# EAGLE design WiFiCPU (EAGLE 6.3)
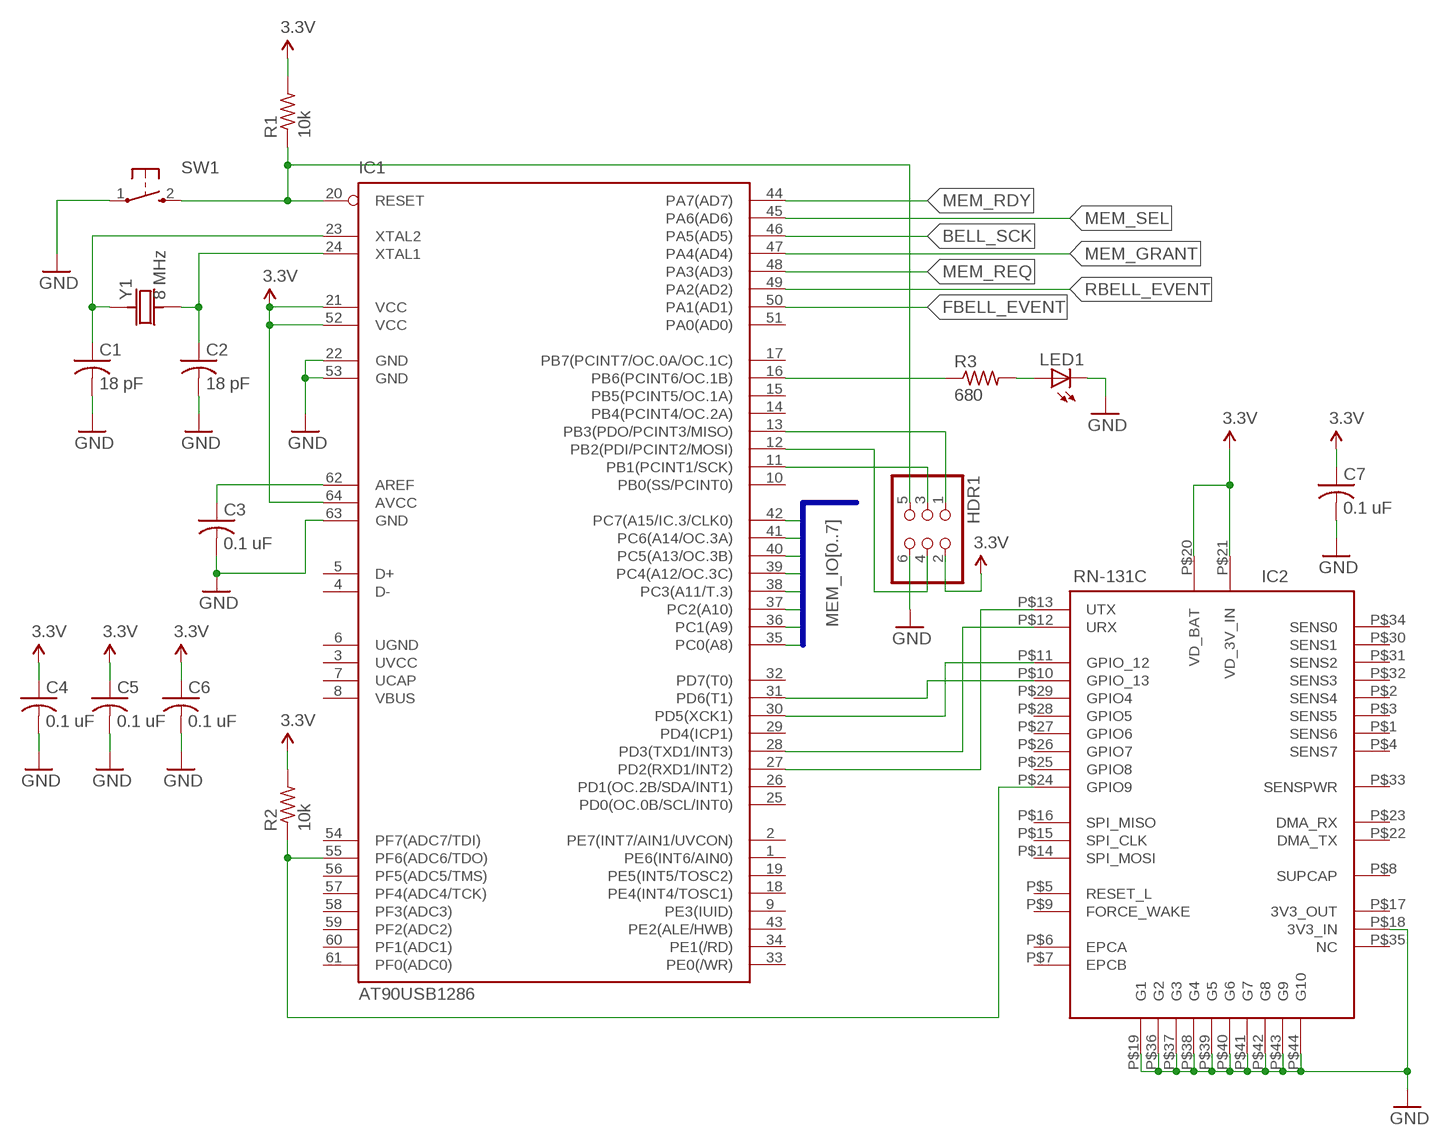
[diagram p0: schematic, sheet 1]

## Parts
C1  18 pF  CAP0603  [0603_CAP]
C2  18 pF  CAP0603  [0603_CAP]
C3  0.1 uF  CAP0603  [0603_CAP]
C4  0.1 uF  CAP0603  [0603_CAP]
C5  0.1 uF  CAP0603  [0603_CAP]
C6  0.1 uF  CAP0603  [0603_CAP]
C7  0.1 uF  CAP0603  [0603_CAP]
HDR1  HEADER_2X3  [HEADER_2X3]
IC1  AT90USB1286  [TQFP64]
IC2  RN-131C  [RN-131G]
LED1  LED0603  [0603_LED]
R1  10k  RESISTOR0603  [0603_RESISTOR]
R2  10k  RESISTOR0603  [0603_RESISTOR]
R3  680  RESISTOR0603  [0603_RESISTOR]
SW1  SWITCH  [SWITCH_TAC]
Y1  8 MHz  CRYSTAL5X3  [CRYSTAL_5X3]

## Nets
3.3V: C4.1 C5.1 C6.1 C7.1 HDR1.2 IC1.21(VCC) IC1.52(VCC) IC1.64(AVCC) IC2.P$20(VD_BAT) IC2.P$21(VD_3V_IN) R1.2 R2.2
BELL_SCK: IC1.46(PA5(AD5))
FBELL_EVENT: IC1.50(PA1(AD1))
GND: C1.2 C2.2 C3.2 C4.2 C5.2 C6.2 C7.2 HDR1.6 IC1.22(GND) IC1.53(GND) IC1.63(GND) IC2.P$18(3V3_IN) IC2.P$19(G1) IC2.P$36(G2) IC2.P$37(G3) IC2.P$38(G4) IC2.P$39(G5) IC2.P$40(G6) IC2.P$41(G7) IC2.P$42(G8) IC2.P$43(G9) IC2.P$44(G10) LED1.C SW1.1
MEM_GRANT: IC1.47(PA4(AD4))
MEM_IO0: IC1.35(PC0(A8))
MEM_IO1: IC1.36(PC1(A9))
MEM_IO2: IC1.37(PC2(A10))
MEM_IO3: IC1.38(PC3(A11/T.3))
MEM_IO4: IC1.39(PC4(A12/OC.3C))
MEM_IO5: IC1.40(PC5(A13/OC.3B))
MEM_IO6: IC1.41(PC6(A14/OC.3A))
MEM_IO7: IC1.42(PC7(A15/IC.3/CLK0))
MEM_RDY: IC1.44(PA7(AD7))
MEM_REQ: IC1.48(PA3(AD3))
MEM_SEL: IC1.45(PA6(AD6))
N$1: C1.1 IC1.23(XTAL2) Y1.1
N$2: C2.1 IC1.24(XTAL1) Y1.2
N$3: IC1.28(PD3(TXD1/INT3)) IC2.P$12(URX)
N$4: IC1.27(PD2(RXD1/INT2)) IC2.P$13(UTX)
N$6: C3.1 IC1.62(AREF)
N$7: IC1.30(PD5(XCK1)) IC2.P$11(GPIO_12)
N$8: IC1.31(PD6(T1)) IC2.P$10(GPIO_13)
N$9: IC1.55(PF6(ADC6/TDO)) IC2.P$24(GPIO9) R2.1
N$10: HDR1.1 IC1.13(PB3(PDO/PCINT3/MISO))
N$11: HDR1.4 IC1.12(PB2(PDI/PCINT2/MOSI))
N$12: HDR1.3 IC1.11(PB1(PCINT1/SCK))
N$13: IC1.16(PB6(PCINT6/OC.1B)) R3.1
N$14: LED1.A R3.2
RBELL_EVENT: IC1.49(PA2(AD2))
WIFI_RESET: HDR1.5 IC1.20(RESET) R1.1 SW1.2
Unconnected: IC1.1(PE6(INT6/AIN0)) IC1.2(PE7(INT7/AIN1/UVCON)) IC1.4(D-) IC1.5(D+) IC1.9(PE3(IUID)) IC1.10(PB0(SS/PCINT0)) IC1.14(PB4(PCINT4/OC.2A)) IC1.15(PB5(PCINT5/OC.1A)) IC1.17(PB7(PCINT7/OC.0A/OC.1C)) IC1.18(PE4(INT4/TOSC1)) IC1.19(PE5(INT5/TOSC2)) IC1.25(PD0(OC.0B/SCL/INT0)) IC1.26(PD1(OC.2B/SDA/INT1)) IC1.29(PD4(ICP1)) IC1.32(PD7(T0)) IC1.33(PE0(/WR)) IC1.34(PE1(/RD)) IC1.43(PE2(ALE/HWB)) IC1.51(PA0(AD0)) IC1.54(PF7(ADC7/TDI)) IC1.56(PF5(ADC5/TMS)) IC1.57(PF4(ADC4/TCK)) IC1.58(PF3(ADC3)) IC1.59(PF2(ADC2)) IC1.60(PF1(ADC1)) IC1.61(PF0(ADC0)) IC2.P$1(SENS6) IC2.P$2(SENS4) IC2.P$3(SENS5) IC2.P$4(SENS7) IC2.P$5(RESET_L) IC2.P$6(EPCA) IC2.P$7(EPCB) IC2.P$8(SUPCAP) IC2.P$9(FORCE_WAKE) IC2.P$14(SPI_MOSI) IC2.P$15(SPI_CLK) IC2.P$16(SPI_MISO) IC2.P$17(3V3_OUT) IC2.P$22(DMA_TX) IC2.P$23(DMA_RX) IC2.P$25(GPIO8) IC2.P$26(GPIO7) IC2.P$27(GPIO6) IC2.P$28(GPIO5) IC2.P$29(GPIO4) IC2.P$30(SENS1) IC2.P$31(SENS2) IC2.P$32(SENS3) IC2.P$33(SENSPWR) IC2.P$34(SENS0) IC2.P$35(NC)

## Buses
MEM_IO[0..7]

## Power pins joined to a net without a drawn wire
UCAP: IC1.7(UCAP)
UGND: IC1.6(UGND)
UVCC: IC1.3(UVCC)
VBUS: IC1.8(VBUS)

## Library data of the parts
C1 C2 = jkf:CAP; DIGIKEY#: 399-1052-1-ND
C3-C7 = jkf:CAP; DIGIKEY#: 399-1096-1-ND
HDR1 = jkf:HEADER_2X3; DIGIKEY#: 609-3487-1-ND; MANF: FCI; MANF#: 95278-101A06LF
IC1 = jkf:AT90USB1286; DIGIKEY#: AT90USB1286-AURCT-ND; MANF: Atmel; MANF#: AT90USB1286-AUR
IC2 = jkf:RN-131C; DIGIKEY#: 740-1036-ND; MANF: Microchip Technology; MANF#: RN131C/RM
LED1 = jkf:LED; DIGIKEY#: 516-2493-1-ND; MANF: Avago Technologies; MANF#: HSMG-C191
R1 R2 = jkf:RESISTOR; DIGIKEY#: P10KGCT-ND
R3 = jkf:RESISTOR; DIGIKEY#: P680GCT-ND
SW1 = jkf:SWITCH; DIGIKEY#: EG4576CT-ND; MANF: E-Switch; MANF#: TL3302AF180QJ
Y1 = jkf:CRYSTAL; DIGIKEY#: 887-1448-1-ND

## Board
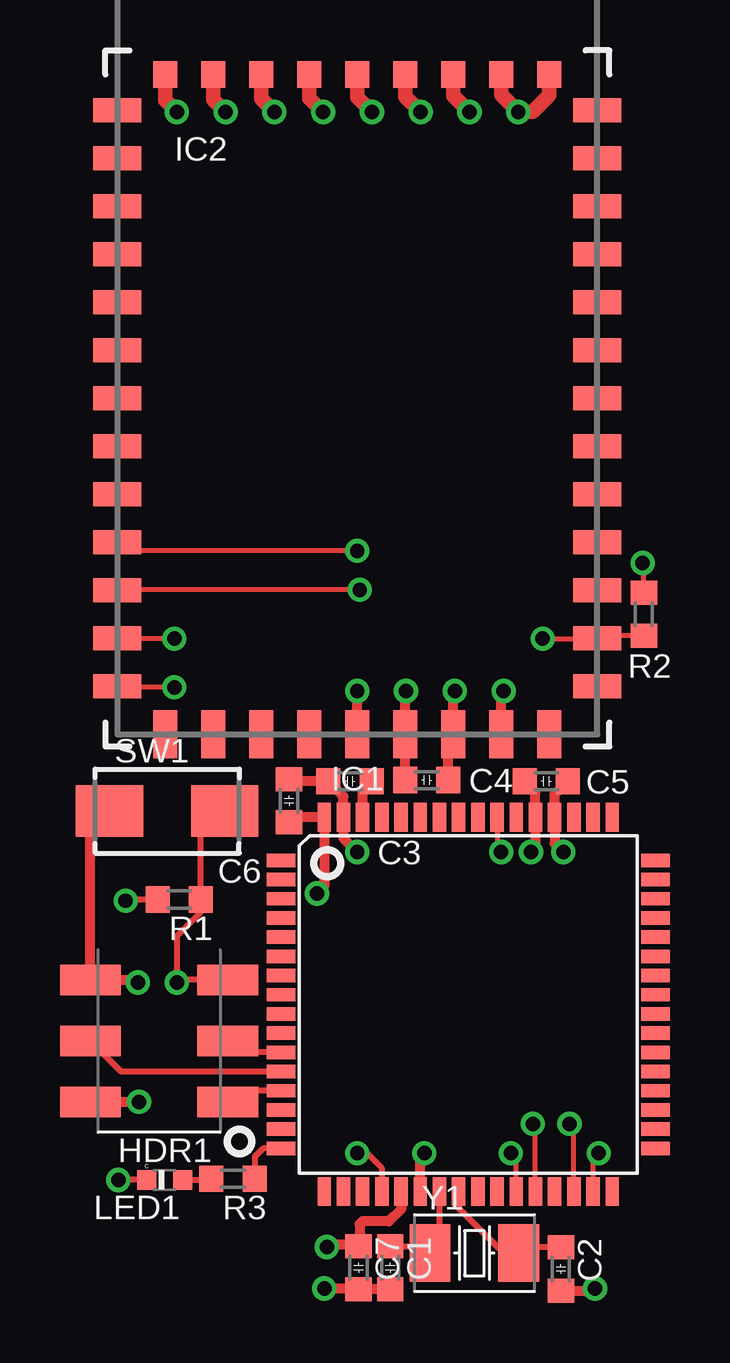
[diagram p1: board, top side]
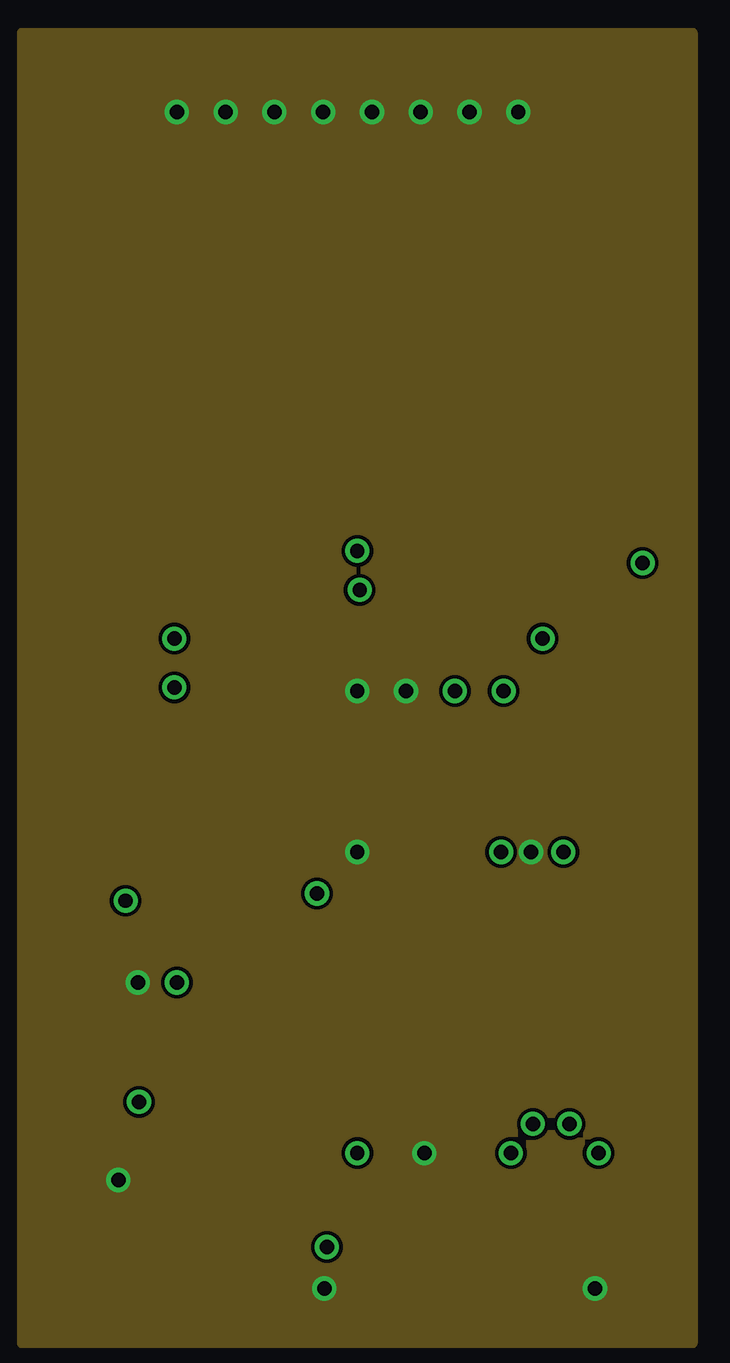
[diagram p2: board, inner layer GND]
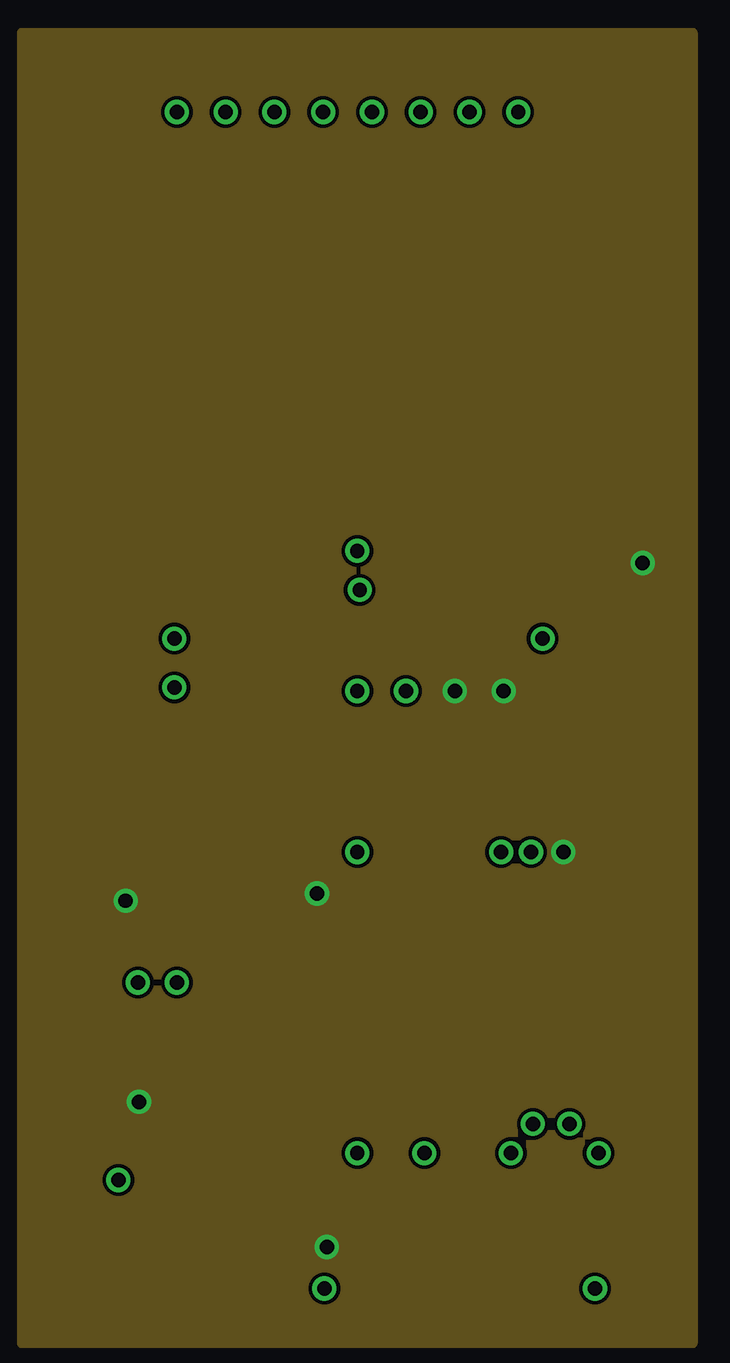
[diagram p3: board, inner layer 3.3V]
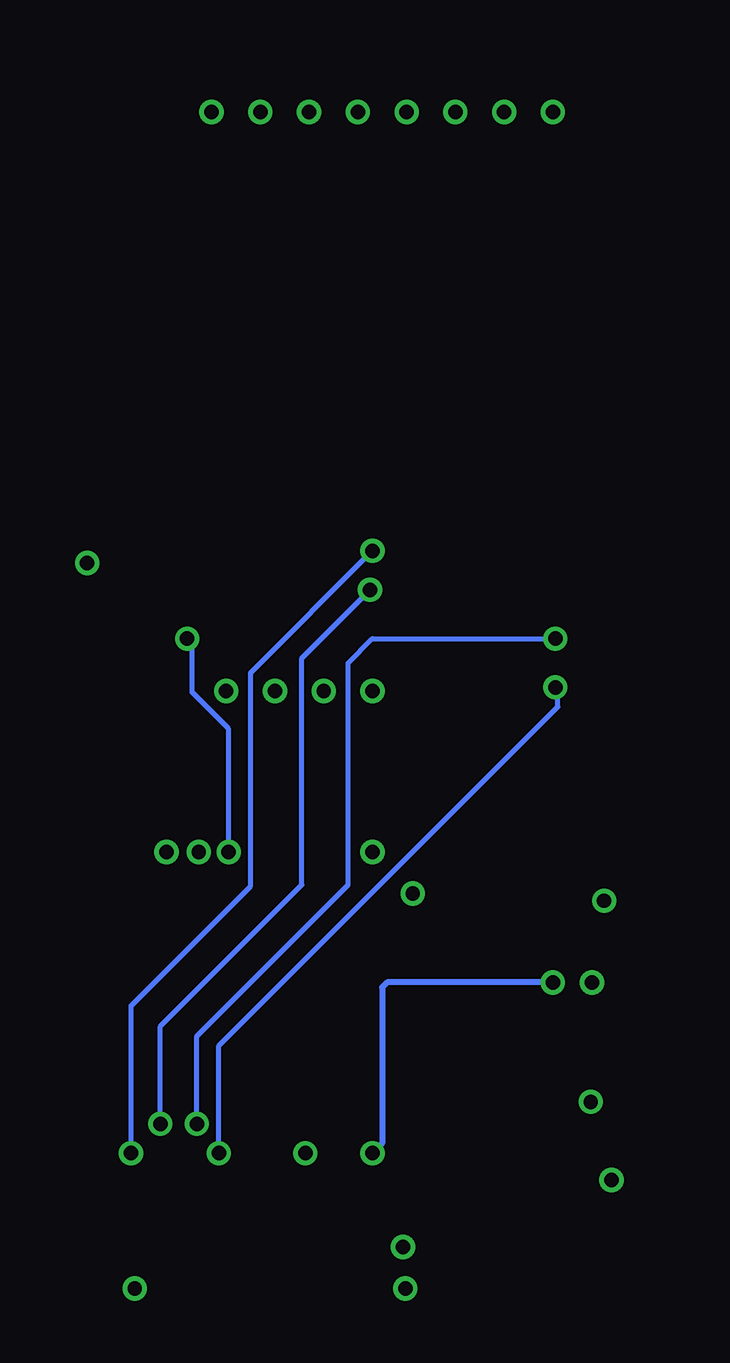
[diagram p4: board, bottom side, seen from below]

No outline drawn. Coordinates in mm, seen from the top.
Copper layers (1+2*15+16): Top 0.0178mm / dielectric 12mil / GND 0.0356mm / dielectric 28mil / 3.3V 0.0356mm / dielectric 12mil / Bottom 0.0178mm
Design rules "SSC-EAGLE-4Lyr_v1.0.0.3": minimum track width 6mil, minimum drill 8mil, track to track 6mil, track to pad 6mil, pad to pad 6mil, via to via 6mil, smd to smd 6mil, copper to edge 20mil, drill to drill 16mil, minimum pad ring 8mil, minimum via ring 8mil, stop-mask expansion 3mil, vias tented up to drill 0mil, thermal gap 10mil

### Footprints (pad centres in the part's own frame; a part is rotated, then mirrored left to right if it is on the bottom)
0603_CAP = smd 1 x 1.1: 1 -0.9,0; 2 0.9,0
HEADER_2X3 = smd 2.54 x 1.27: 1 -2.675,2.54; 2 3.04,2.54; 3 -2.675,0; 4 3.04,0; 5 -2.675,-2.54; 6 3.04,-2.54
TQFP64 = smd 1.194 x 0.559: 1 -7.8,6; 2 -7.8,5.2; 3 -7.8,4.4; 4 -7.8,3.6; 5 -7.8,2.8; 6 -7.8,2; 7 -7.8,1.2; 8 -7.8,0.4; 9 -7.8,-0.4; 10 -7.8,-1.2; 11 -7.8,-2; 12 -7.8,-2.8; 13 -7.8,-3.6; 14 -7.8,-4.4; 15 -7.8,-5.2; 16 -7.8,-6; 33 7.8,-6; 34 7.8,-5.2; 35 7.8,-4.4; 36 7.8,-3.6; 37 7.8,-2.8; 38 7.8,-2; 39 7.8,-1.2; 40 7.8,-0.4; 41 7.8,0.4; 42 7.8,1.2; 43 7.8,2; 44 7.8,2.8; 45 7.8,3.6; 46 7.8,4.4; 47 7.8,5.2; 48 7.8,6 | smd 0.559 x 1.194: 17 -6,-7.8; 18 -5.2,-7.8; 19 -4.4,-7.8; 20 -3.6,-7.8; 21 -2.8,-7.8; 22 -2,-7.8; 23 -1.2,-7.8; 24 -0.4,-7.8; 25 0.4,-7.8; 26 1.2,-7.8; 27 2,-7.8; 28 2.8,-7.8; 29 3.6,-7.8; 30 4.4,-7.8; 31 5.2,-7.8; 32 6,-7.8; 49 6,7.8; 50 5.2,7.8; 51 4.4,7.8; 52 3.6,7.8; 53 2.8,7.8; 54 2,7.8; 55 1.2,7.8; 56 0.4,7.8; 57 -0.4,7.8; 58 -1.2,7.8; 59 -2,7.8; 60 -2.8,7.8; 61 -3.6,7.8; 62 -4.4,7.8; 63 -5.2,7.8; 64 -6,7.8
RN-131G = smd 2 x 1: P$1 -10,12; P$2 -10,10; P$3 -10,8; P$4 -10,6; P$5 -10,4; P$6 -10,2; P$7 -10,0; P$8 -10,-2; P$9 -10,-4; P$10 -10,-6; P$11 -10,-8; P$12 -10,-10; P$13 -10,-12; P$23 10,-12; P$24 10,-10; P$25 10,-8; P$26 10,-6; P$27 10,-4; P$28 10,-2; P$29 10,0; P$30 10,2; P$31 10,4; P$32 10,6; P$33 10,8; P$34 10,10; P$35 10,12 | smd 1 x 2: P$14 -8,-14; P$15 -6,-14; P$16 -4,-14; P$17 -2,-14; P$18 0,-14; P$19 2,-14; P$20 4,-14; P$21 6,-14; P$22 8,-14 | smd 1 x 1.11: P$36 8,13.492; P$37 6,13.492; P$38 4,13.492; P$39 2,13.492; P$40 0,13.492; P$41 -2,13.492; P$42 -4,13.492; P$43 -6,13.492; P$44 -8,13.492
0603_LED = smd 0.8 x 0.8: A -0.75,0; C 0.75,0
0603_RESISTOR = smd 1 x 1.1: 1 -0.9,0; 2 0.9,0
SWITCH_TAC = smd 2.8 x 2.16: 1 -2.4,-0.02; 2 2.4,-0.02
CRYSTAL_5X3 = smd 1.7 x 2.4: 1 -1.85,0; 2 1.85,0

### Placement (x,y rotation side)
C1  15.34,3.15 270 top
C2  22.45,3.1 270 top
C3  13.67,23.42 180 top
C4  16.87,23.47 180 top
C5  21.84,23.42 180 top
C6  11.13,22.61 90 top
C7  14.02,3.15 270 top
HDR1  5.89,12.6 180 top
IC1  18.59,14.12 0 top
IC2  13.97,39.37 0 top
LED1  5.94,6.81 180 top
R1  6.55,18.49 180 top
R2  25.91,30.38 90 top
R3  8.79,6.86 180 top
SW1  6.05,22.2 0 top
Y1  18.85,3.76 0 top

### Tracks (layer width: path | path; a pad name or v marks a point on that pad's centre or on a via)
3.3V  (via drill 0.6)
  Top 0.203: R2.2 25.91,32.46 v25.86,32.51
  Top 0.254: 13.97,4.1 C7.1 | 12.79,4.1 v12.7,4.01 | R1.2 4.37,18.49 v4.32,18.44
  Top 0.406: 13.97,4.1 12.79,4.1 | v12.29,18.75 12.59,19.04 IC1.64 11.34,21.92 C6.1 | IC1.21 15.79,5.58 15.29,5.08 14.17,5.08 14.07,4.98 14.07,4.1 C7.1 | HDR1.2 v4.88,10.06 | v18.03,27.18 17.97,27.11 IC2.P$20 17.77,25.17 C4.1 | IC2.P$21 19.97,27.08 v20.07,27.18 | v22.55,20.47 22.19,20.84 IC1.52 22.19,22.87 C5.1
  pour 3.3V: 0,54.61 27.94,54.61 27.94,0 0,0
GND  (via drill 0.6)
  Top 0.254: LED1.C v4.01,6.81 | 2.85,21.39 SW1.1
  Top 0.406: 2.85,21.39 HDR1.6 4.72,15.14 v4.83,15.04 | C6.2 11.21,23.42 C3.2 13.39,22.79 IC1.63 13.39,21.05 v13.97,20.47 | C1.2 C7.2 13.98,2.29 v12.6,2.29 | IC1.22 16.59,7.75 v16.76,7.92 | C2.2 23.79,2.2 v23.88,2.29 | IC2.P$18 v13.97,27.18 | v16,27.18 15.97,27.15 IC2.P$19 C4.2 | v21.21,20.47 21.39,20.66 IC1.53 21.39,22.97 C5.2
  Top 0.61: IC2.P$44 5.97,51.79 v6.45,51.31 | IC2.P$43 7.97,51.82 v8.48,51.31 | IC2.P$42 9.97,51.85 v10.52,51.31 | IC2.P$41 11.97,51.89 v12.55,51.31 | IC2.P$40 13.97,51.92 v14.58,51.31 | IC2.P$39 15.97,51.95 v16.61,51.31 | IC2.P$38 17.97,51.98 v18.64,51.31 | IC2.P$37 19.97,52.01 v20.68,51.31 21.29,51.31 21.97,51.99 IC2.P$36
  pour GND: 0,54.61 27.94,54.61 27.94,0 0,0
N$1
  Top 0.254: C1.1 16.71,4.05 Y1.1 17.39,4.16 IC1.23
N$2
  Top 0.254: IC1.24 18.19,5.63 19.86,3.96 20.49,3.96 Y1.2 20.94,4 C2.1
N$3  (via drill 0.6)
  Top 0.203: IC1.28 21.39,9.04 v21.29,9.14 | v6.35,29.36 IC2.P$12
  Bottom 0.203: v21.29,9.14 21.29,12.8 14.99,19.1 14.99,28.35 13.97,29.36 v6.35,29.36
N$4  (via drill 0.6)
  Top 0.203: IC1.27 20.59,7.7 v20.37,7.92 | v6.35,27.33 4.01,27.33 IC2.P$13
  Bottom 0.203: v20.37,7.92 20.37,12.39 6.25,26.52 6.25,27.23 v6.35,27.33
N$6
  Top 0.406: IC1.62 14.19,23.05 C3.1
N$7  (via drill 0.6)
  Top 0.203: IC1.30 22.99,8.96 v22.81,9.14 | v14.07,31.39 3.99,31.39 IC2.P$11
  Bottom 0.203: v22.81,9.14 22.81,13.21 16.92,19.1 16.92,28.55 v14.07,31.39
N$8  (via drill 0.6)
  Top 0.203: IC1.31 23.79,7.69 v24.03,7.92 | v13.97,33.02 4.32,33.02 IC2.P$10
  Bottom 0.203: v24.03,7.92 24.03,14.07 19.05,19.05 19.05,27.94 v13.97,33.02
N$9  (via drill 0.6)
  Top 0.203: R2.1 24.08,29.48 IC2.P$24 v21.69,29.36 | IC1.55 19.79,20.59 v19.96,20.47
  Bottom 0.203: v19.96,20.47 19.96,25.6 21.49,27.13 21.49,29.16 v21.69,29.36
N$10
  Top 0.254: IC1.13 9.03,10.52 HDR1.1
N$11
  Top 0.254: IC1.12 4.13,11.32 HDR1.4
N$12
  Top 0.254: IC1.11 9.04,12.12 HDR1.3
N$13
  Top 0.254: IC1.16 10.05,8.12 9.7,7.77 9.7,6.87 R3.1
N$14
  Top 0.254: LED1.A 7.84,6.81 R3.2
WIFI_RESET  (via drill 0.6)
  Top 0.254: HDR1.5 6.55,15.14 v6.45,15.04 6.45,16.97 7.45,17.97 R1.1 7.45,21.19 SW1.2 | v13.97,7.92 14.38,7.92 14.99,7.32 IC1.20
  Bottom 0.254: v6.45,15.04 13.36,15.04 13.56,14.83 13.56,8.33 v13.97,7.92